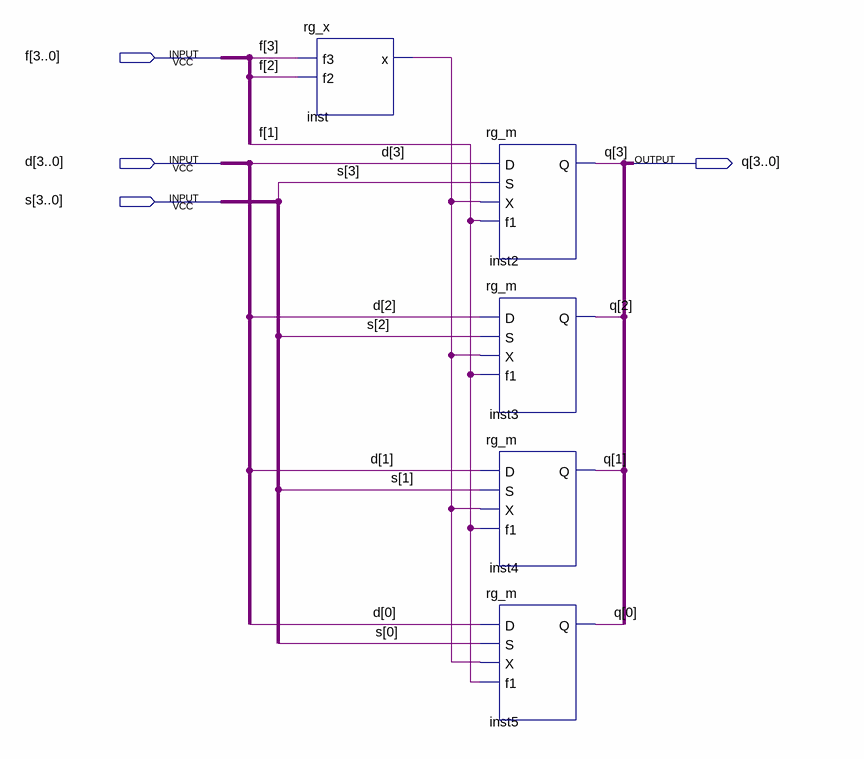
[diagram p0: schematic sheet]
// Quartus schematic rg.bdf as structural Verilog: 5 symbols, 4 pins
module rg (
  input  [3:0] f,
  input  [3:0] d,
  input  [3:0] s,
  output [3:0] q
);

  wire inst_x;

  rg_x inst (.f3(f[3]), .f2(f[2]), .x(inst_x));
  rg_m inst2 (.D(d[3]), .S(s[3]), .X(inst_x), .f1(f[1]), .Q(q[3]));
  rg_m inst3 (.D(d[2]), .S(s[2]), .X(inst_x), .f1(f[1]), .Q(q[2]));
  rg_m inst4 (.D(d[1]), .S(s[1]), .X(inst_x), .f1(f[1]), .Q(q[1]));
  rg_m inst5 (.D(d[0]), .S(s[0]), .X(inst_x), .f1(f[1]), .Q(q[0]));
endmodule
